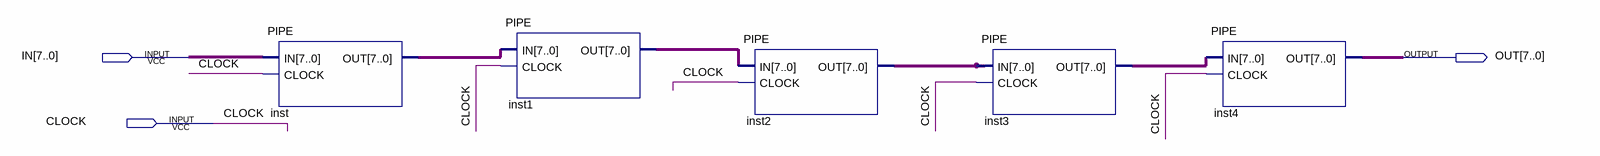
[diagram p0: schematic sheet]
// Quartus schematic PIPE_5CLOCKS.bdf as structural Verilog: 5 symbols, 3 pins
module PIPE_5CLOCKS (
  input  [7:0] IN,
  input  CLOCK,
  output [7:0] OUT
);

  wire [7:0] inst1_out, inst2_out, inst3_out, inst_out;

  PIPE inst (.IN(IN), .CLOCK(CLOCK), .OUT(inst_out));
  PIPE inst1 (.IN(inst_out), .CLOCK(CLOCK), .OUT(inst1_out));
  PIPE inst2 (.IN(inst1_out), .CLOCK(CLOCK), .OUT(inst2_out));
  PIPE inst3 (.IN(inst2_out), .CLOCK(CLOCK), .OUT(inst3_out));
  PIPE inst4 (.IN(inst3_out), .CLOCK(CLOCK), .OUT(OUT));
endmodule
